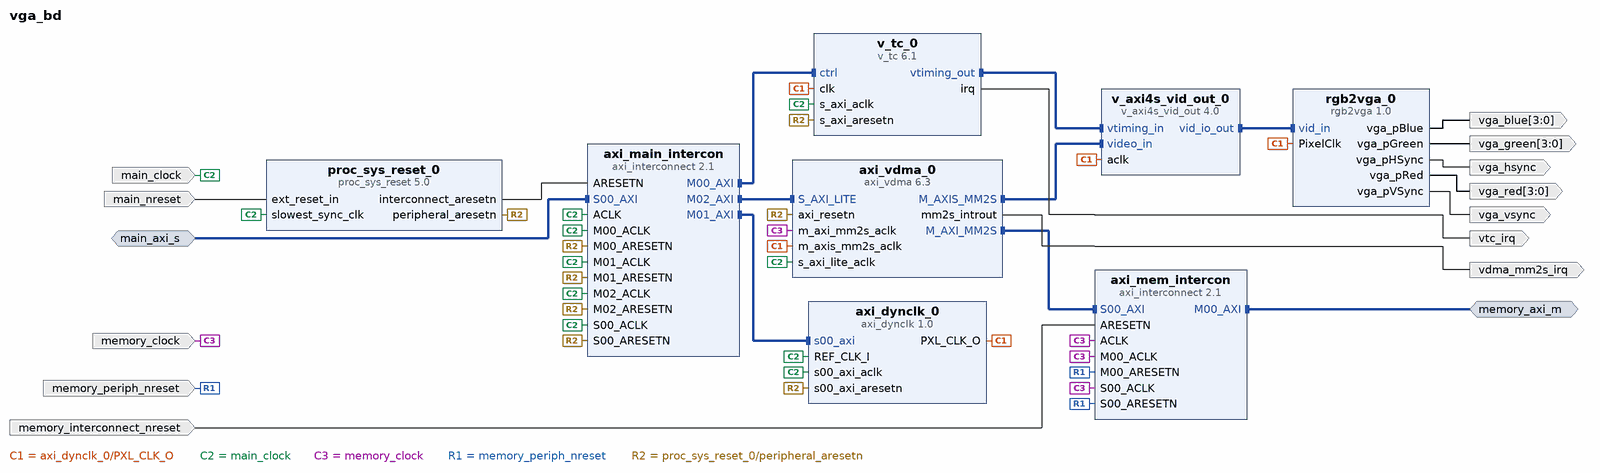
[diagram p0: block diagram of the top level]
# Vivado block design vga_bd, xc7a100tcsg324-1, Vivado 2017.4
create_bd_design vga_bd

create_bd_intf_port -mode Slave -vlnv xilinx.com:interface:aximm_rtl:1.0 main_axi_s
set_property -dict [list \
  CONFIG.DATA_WIDTH 32 \
  CONFIG.PROTOCOL AXI4 \
  CONFIG.ID_WIDTH 0 \
  CONFIG.ADDR_WIDTH 32 \
  CONFIG.AWUSER_WIDTH 0 \
  CONFIG.ARUSER_WIDTH 0 \
  CONFIG.WUSER_WIDTH 0 \
  CONFIG.RUSER_WIDTH 0 \
  CONFIG.BUSER_WIDTH 0 \
  CONFIG.READ_WRITE_MODE READ_WRITE \
  CONFIG.HAS_BURST 1 \
  CONFIG.HAS_LOCK 1 \
  CONFIG.HAS_PROT 1 \
  CONFIG.HAS_CACHE 1 \
  CONFIG.HAS_QOS 1 \
  CONFIG.HAS_REGION 0 \
  CONFIG.HAS_WSTRB 1 \
  CONFIG.HAS_BRESP 1 \
  CONFIG.HAS_RRESP 1 \
  CONFIG.SUPPORTS_NARROW_BURST 1 \
  CONFIG.NUM_READ_OUTSTANDING 2 \
  CONFIG.NUM_WRITE_OUTSTANDING 2 \
  CONFIG.MAX_BURST_LENGTH 256 \
  CONFIG.NUM_READ_THREADS 1 \
  CONFIG.NUM_WRITE_THREADS 1 \
  CONFIG.RUSER_BITS_PER_BYTE 0 \
  CONFIG.WUSER_BITS_PER_BYTE 0 \
] [get_bd_intf_ports main_axi_s]
create_bd_intf_port -mode Master -vlnv xilinx.com:interface:aximm_rtl:1.0 memory_axi_m
set_property -dict [list \
  CONFIG.DATA_WIDTH 32 \
  CONFIG.PROTOCOL AXI4 \
  CONFIG.FREQ_HZ 150000000 \
  CONFIG.ADDR_WIDTH 32 \
  CONFIG.NUM_READ_OUTSTANDING 2 \
  CONFIG.NUM_WRITE_OUTSTANDING 2 \
] [get_bd_intf_ports memory_axi_m]
create_bd_port -dir I -type clk main_clock
set_property -dict {CONFIG.FREQ_HZ 100000000 CONFIG.ASSOCIATED_RESET main_nreset} [get_bd_ports main_clock]
create_bd_port -dir I -type rst main_nreset
create_bd_port -dir I -type clk memory_clock
set_property -dict [list \
  CONFIG.FREQ_HZ 150000000 \
  CONFIG.ASSOCIATED_BUSIF memory_axi_m \
  CONFIG.ASSOCIATED_RESET memory_interconnect_nreset:memory_periph_nreset \
] [get_bd_ports memory_clock]
create_bd_port -dir I -type rst memory_interconnect_nreset
create_bd_port -dir I -type rst memory_periph_nreset
create_bd_port -dir O -type intr vdma_mm2s_irq
create_bd_port -dir O -from 3 -to 0 vga_blue
create_bd_port -dir O -from 3 -to 0 vga_green
create_bd_port -dir O vga_hsync
create_bd_port -dir O -from 3 -to 0 vga_red
create_bd_port -dir O vga_vsync
create_bd_port -dir O -type intr vtc_irq

create_bd_cell -type ip -vlnv digilentinc.com:ip:axi_dynclk:1.0 axi_dynclk_0
create_bd_cell -type ip -vlnv xilinx.com:ip:axi_interconnect:2.1 axi_main_intercon
set_property -dict {CONFIG.NUM_MI 3} [get_bd_cells axi_main_intercon]
create_bd_cell -type ip -vlnv xilinx.com:ip:axi_interconnect:2.1 axi_mem_intercon
set_property -dict {CONFIG.NUM_SI 1 CONFIG.NUM_MI 1} [get_bd_cells axi_mem_intercon]
create_bd_cell -type ip -vlnv xilinx.com:ip:axi_vdma:6.3 axi_vdma_0
set_property -dict [list \
  CONFIG.c_m_axi_mm2s_data_width 32 \
  CONFIG.c_m_axis_mm2s_tdata_width 24 \
  CONFIG.c_mm2s_genlock_mode 0 \
  CONFIG.c_mm2s_max_burst_length 32 \
  CONFIG.c_include_s2mm 0 \
] [get_bd_cells axi_vdma_0]
create_bd_cell -type ip -vlnv xilinx.com:ip:proc_sys_reset:5.0 proc_sys_reset_0
create_bd_cell -type ip -vlnv digilentinc.com:ip:rgb2vga:1.0 rgb2vga_0
set_property -dict {CONFIG.kBlueDepth 4 CONFIG.kGreenDepth 4 CONFIG.kRedDepth 4} [get_bd_cells rgb2vga_0]
create_bd_cell -type ip -vlnv xilinx.com:ip:v_axi4s_vid_out:4.0 v_axi4s_vid_out_0
set_property -dict {CONFIG.C_ADDR_WIDTH 5 CONFIG.C_VTG_MASTER_SLAVE 1} [get_bd_cells v_axi4s_vid_out_0]
create_bd_cell -type ip -vlnv xilinx.com:ip:v_tc:6.1 v_tc_0
set_property -dict {CONFIG.enable_detection false} [get_bd_cells v_tc_0]

# ---- connections ----

connect_bd_intf_net -intf_net axi_proc_intercon_M00_AXI [get_bd_intf_pins v_tc_0/ctrl] [get_bd_intf_pins axi_main_intercon/M00_AXI]
connect_bd_intf_net -intf_net axi_proc_intercon_M01_AXI [get_bd_intf_pins axi_dynclk_0/s00_axi] [get_bd_intf_pins axi_main_intercon/M01_AXI]
connect_bd_intf_net -intf_net axi_proc_intercon_M02_AXI [get_bd_intf_pins axi_vdma_0/S_AXI_LITE] [get_bd_intf_pins axi_main_intercon/M02_AXI]
connect_bd_intf_net [get_bd_intf_pins axi_vdma_0/M_AXIS_MM2S] [get_bd_intf_pins v_axi4s_vid_out_0/video_in]
connect_bd_intf_net [get_bd_intf_pins axi_vdma_0/M_AXI_MM2S] [get_bd_intf_pins axi_mem_intercon/S00_AXI]
connect_bd_intf_net [get_bd_intf_pins v_axi4s_vid_out_0/vid_io_out] [get_bd_intf_pins rgb2vga_0/vid_in]
connect_bd_intf_net [get_bd_intf_pins v_tc_0/vtiming_out] [get_bd_intf_pins v_axi4s_vid_out_0/vtiming_in]
connect_bd_intf_net -intf_net S00_AXI_0_1 [get_bd_intf_ports main_axi_s] [get_bd_intf_pins axi_main_intercon/S00_AXI]
connect_bd_intf_net [get_bd_intf_ports memory_axi_m] [get_bd_intf_pins axi_mem_intercon/M00_AXI]
connect_bd_net -net ARESETN_1 [get_bd_pins proc_sys_reset_0/interconnect_aresetn] [get_bd_pins axi_main_intercon/ARESETN]
connect_bd_net [get_bd_pins axi_dynclk_0/PXL_CLK_O] \
  [get_bd_pins rgb2vga_0/PixelClk] [get_bd_pins v_axi4s_vid_out_0/aclk] [get_bd_pins v_tc_0/clk] \
  [get_bd_pins axi_vdma_0/m_axis_mm2s_aclk]
connect_bd_net [get_bd_pins axi_vdma_0/mm2s_introut] [get_bd_ports vdma_mm2s_irq]
connect_bd_net [get_bd_ports main_clock] \
  [get_bd_pins proc_sys_reset_0/slowest_sync_clk] [get_bd_pins axi_dynclk_0/REF_CLK_I] \
  [get_bd_pins axi_dynclk_0/s00_axi_aclk] [get_bd_pins v_tc_0/s_axi_aclk] [get_bd_pins axi_vdma_0/s_axi_lite_aclk] \
  [get_bd_pins axi_main_intercon/ACLK] [get_bd_pins axi_main_intercon/S00_ACLK] [get_bd_pins axi_main_intercon/M00_ACLK] \
  [get_bd_pins axi_main_intercon/M01_ACLK] [get_bd_pins axi_main_intercon/M02_ACLK]
connect_bd_net [get_bd_ports main_nreset] [get_bd_pins proc_sys_reset_0/ext_reset_in]
connect_bd_net [get_bd_ports memory_clock] \
  [get_bd_pins axi_vdma_0/m_axi_mm2s_aclk] [get_bd_pins axi_mem_intercon/M00_ACLK] [get_bd_pins axi_mem_intercon/ACLK] \
  [get_bd_pins axi_mem_intercon/S00_ACLK]
connect_bd_net [get_bd_ports memory_interconnect_nreset] [get_bd_pins axi_mem_intercon/ARESETN]
connect_bd_net -net memory_nreset_1 [get_bd_ports memory_periph_nreset] \
  [get_bd_pins axi_mem_intercon/M00_ARESETN] [get_bd_pins axi_mem_intercon/S00_ARESETN]
connect_bd_net [get_bd_pins proc_sys_reset_0/peripheral_aresetn] \
  [get_bd_pins v_tc_0/s_axi_aresetn] [get_bd_pins axi_dynclk_0/s00_axi_aresetn] [get_bd_pins axi_vdma_0/axi_resetn] \
  [get_bd_pins axi_main_intercon/M02_ARESETN] [get_bd_pins axi_main_intercon/M01_ARESETN] \
  [get_bd_pins axi_main_intercon/M00_ARESETN] [get_bd_pins axi_main_intercon/S00_ARESETN]
connect_bd_net [get_bd_pins rgb2vga_0/vga_pBlue] [get_bd_ports vga_blue]
connect_bd_net [get_bd_pins rgb2vga_0/vga_pGreen] [get_bd_ports vga_green]
connect_bd_net [get_bd_pins rgb2vga_0/vga_pHSync] [get_bd_ports vga_hsync]
connect_bd_net [get_bd_pins rgb2vga_0/vga_pRed] [get_bd_ports vga_red]
connect_bd_net [get_bd_pins rgb2vga_0/vga_pVSync] [get_bd_ports vga_vsync]
connect_bd_net [get_bd_pins v_tc_0/irq] [get_bd_ports vtc_irq]

# ---- address map ----
assign_bd_address -offset 0x44A30000 -range 64K -target_address_space [get_bd_addr_spaces axi_vdma_0/Data_MM2S] [get_bd_addr_segs memory_axi_m/Reg]
assign_bd_address -offset 0x44A00000 -range 64K -target_address_space [get_bd_addr_spaces main_axi_s] [get_bd_addr_segs axi_dynclk_0/s00_axi/reg0]
assign_bd_address -offset 0x44A10000 -range 64K -target_address_space [get_bd_addr_spaces main_axi_s] [get_bd_addr_segs axi_vdma_0/S_AXI_LITE/Reg]
assign_bd_address -offset 0x44A20000 -range 64K -target_address_space [get_bd_addr_spaces main_axi_s] [get_bd_addr_segs v_tc_0/ctrl/Reg]

validate_bd_design
save_bd_design
